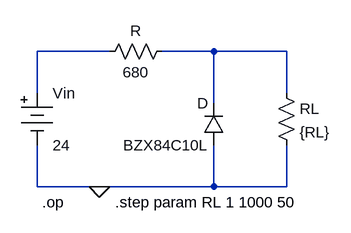
[diagram p0: schematic 2-vr.asc]
2-vr.asc, the LTspice schematic file:
Version 4.1
SHEET 1 880 680
WIRE 176 64 64 64
WIRE 336 64 256 64
WIRE 448 64 336 64
WIRE 64 128 64 64
WIRE 448 128 448 64
WIRE 336 144 336 64
WIRE 64 272 64 208
WIRE 160 272 64 272
WIRE 336 272 336 208
WIRE 336 272 160 272
WIRE 448 272 448 208
WIRE 448 272 336 272
FLAG 160 272 0
SYMBOL Misc\\battery 64 112 R0
SYMATTR InstName Vin
SYMATTR Value 24
SYMBOL res 432 112 R0
SYMATTR InstName RL
SYMATTR Value {RL}
SYMBOL res 272 48 R90
WINDOW 0 0 56 VBottom 2
WINDOW 3 32 56 VTop 2
SYMATTR InstName R
SYMATTR Value 680
SYMBOL diode 352 208 R180
WINDOW 0 24 64 Left 2
WINDOW 3 24 0 Left 2
SYMATTR InstName D
SYMATTR Value BZX84C10L
TEXT 184 296 Left 2 !.step param RL 1 1000 50
TEXT 72 296 Left 2 !.op

The netlist it stands for:
* 2-vr.asc
Vin N001 0 24
RL N002 0 {RL}
R N002 N001 680
D 0 N002 BZX84C10L
.model D D
.lib standard.dio
.step param RL 1 1000 50
.op
.backanno
.end